# Altium schematic sheet 29.SchDoc
size 513 x 386 mm
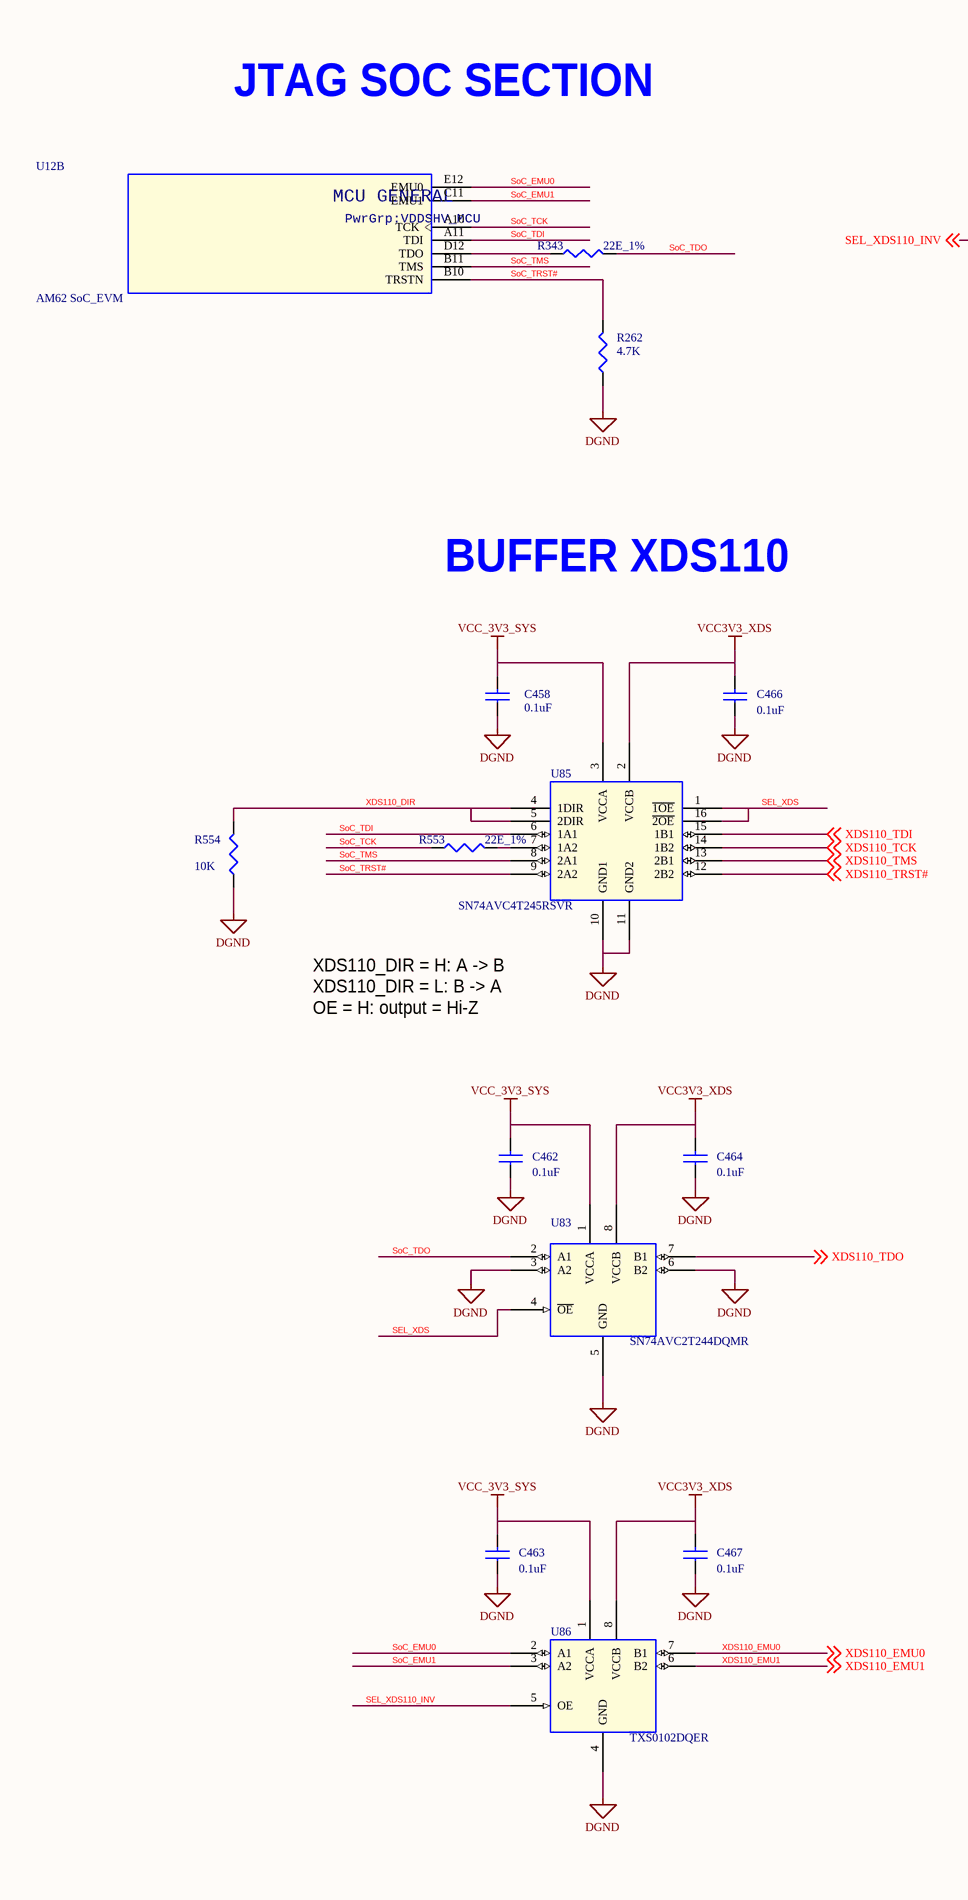
[diagram p0: 29.SchDoc, left]
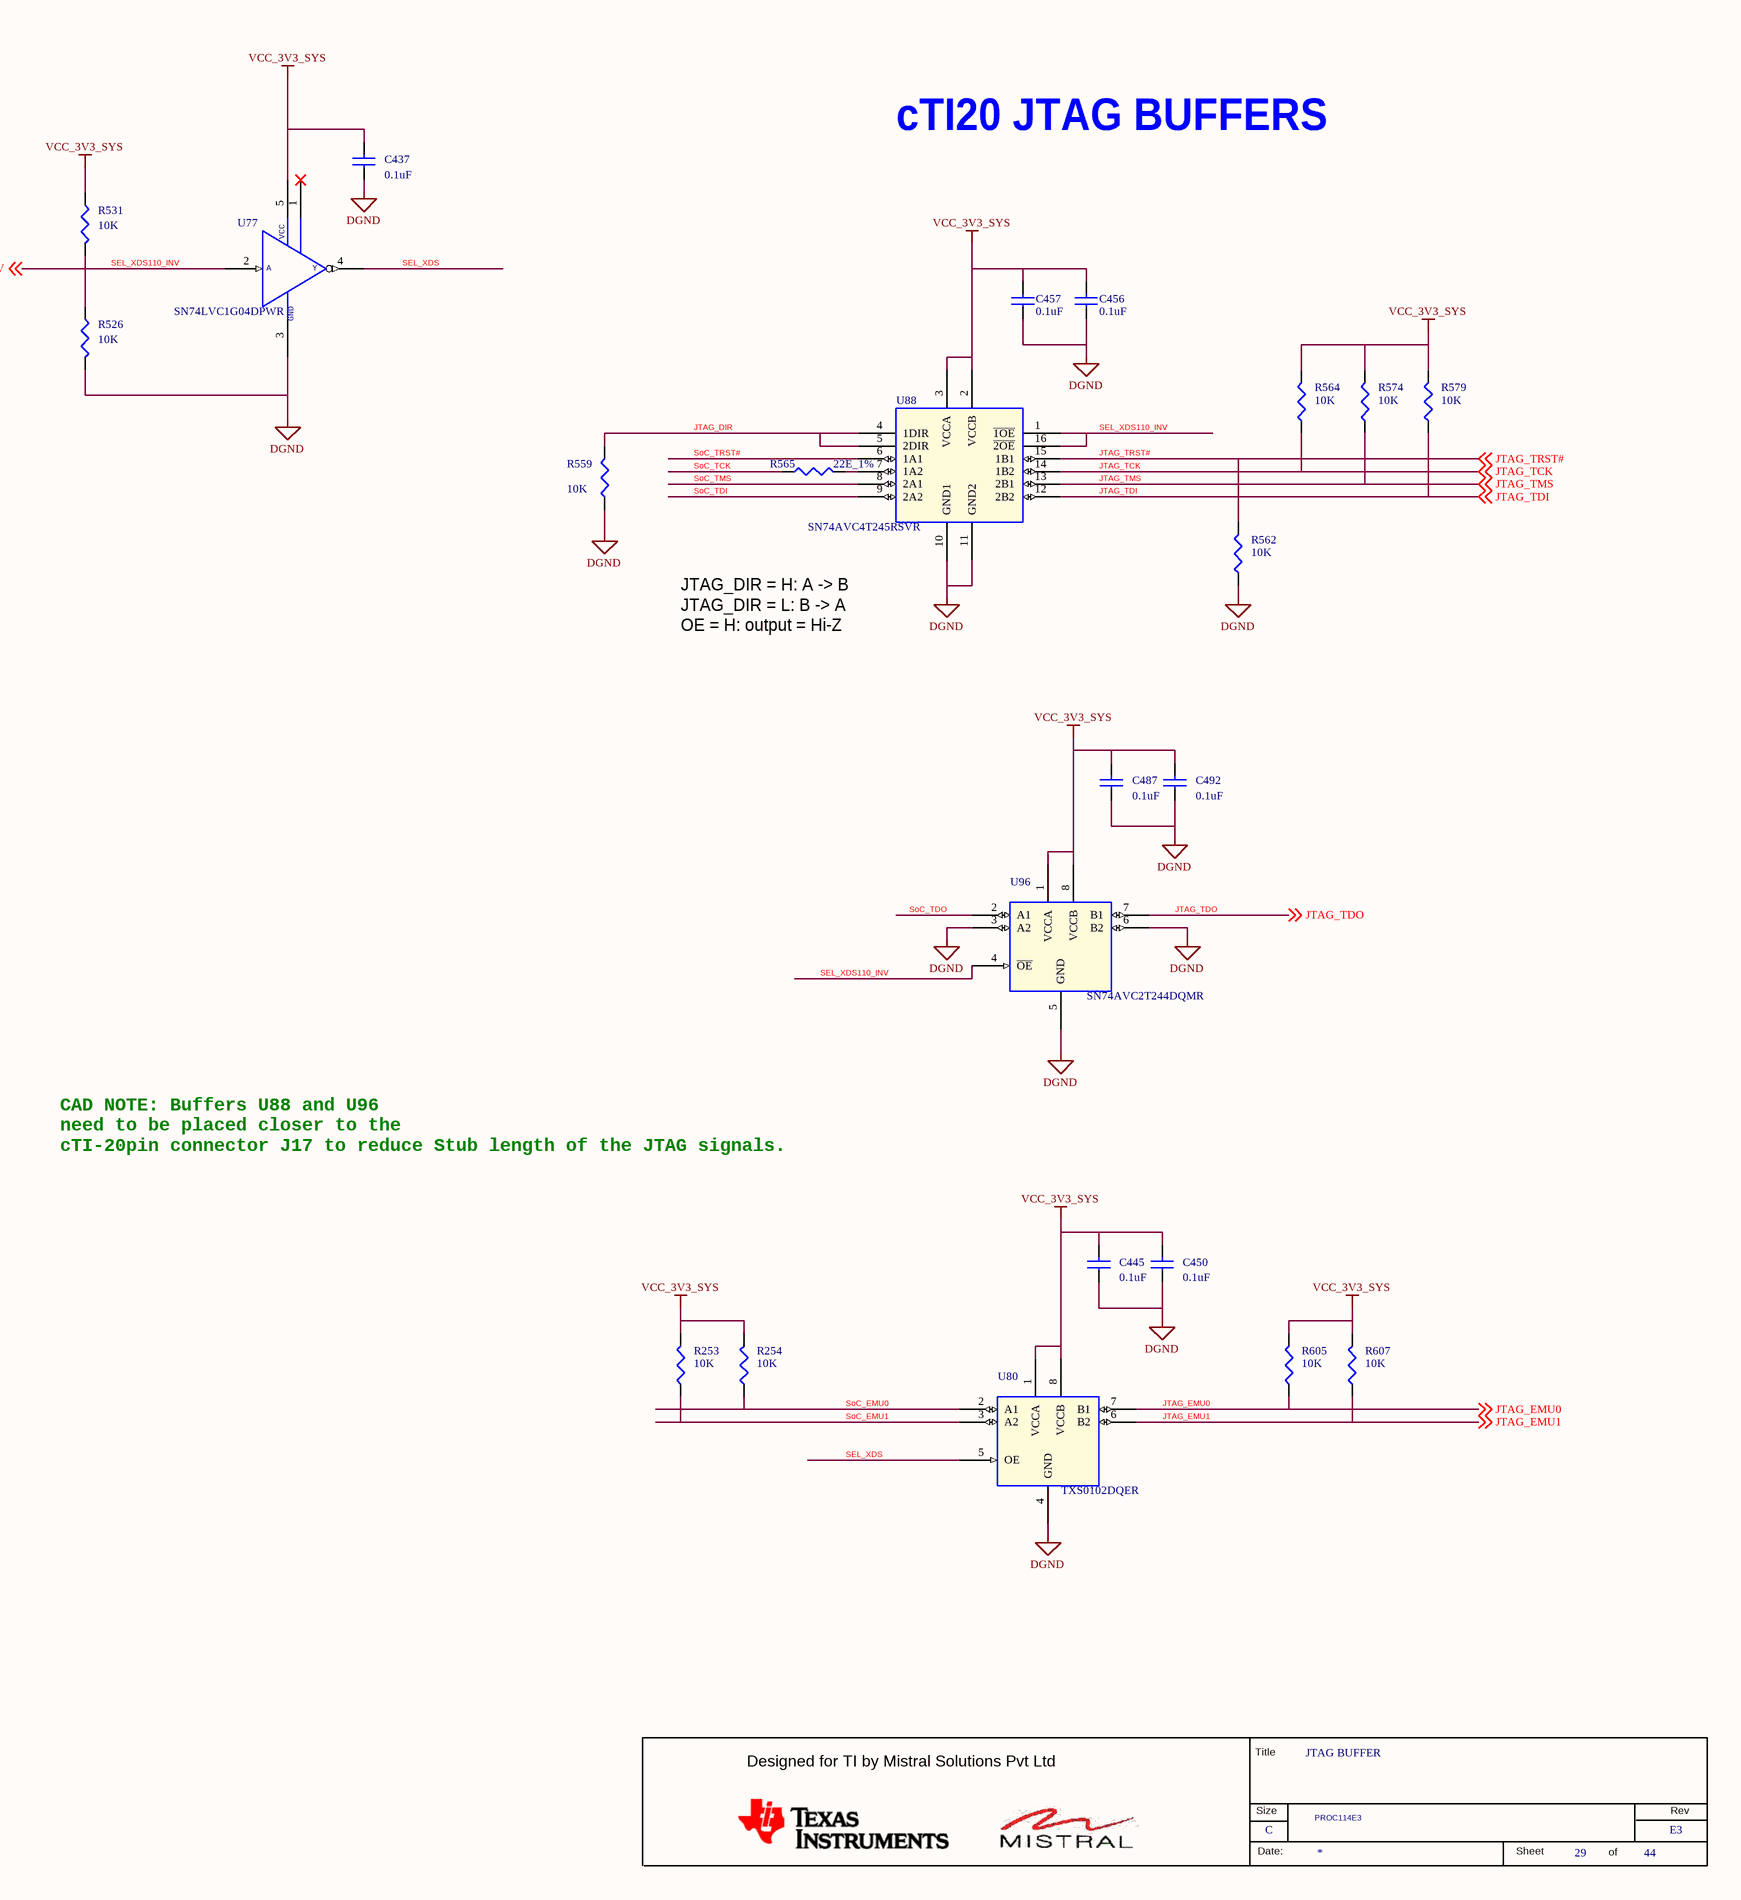
[diagram p1: 29.SchDoc, right]

## Parts
*  RevCode: E3  Title: JTAG BUFFER  Page Size: C  Page Number: 29  Page Count: 44  Variant Name: PROC114E3  (hidden comment: MISTRAL_TITLEBLK_CSIZE)  (graphical)
C437  0.1uF  [CAP0201_0-5]
C445  0.1uF  [CAP0201_0-5]
C450  0.1uF  [CAP0201_0-5]
C456  0.1uF  [CAP0201_0-5]
C457  0.1uF  [CAP0201_0-5]
C458  0.1uF  [CAP0201_0-5]
C462  0.1uF  [CAP0201_0-5]
C463  0.1uF  [CAP0201_0-5]
C464  0.1uF  [CAP0201_0-5]
C466  0.1uF  [CAP0201_0-5]
C467  0.1uF  [CAP0201_0-5]
C487  0.1uF  [CAP0201_0-5]
C492  0.1uF  [CAP0201_0-5]
R253  10K  [RES0201_0-5]
R254  10K  [RES0201_0-5]
R262  4.7K  [RES0201_0-5]
R343  22E_1%  [RES0201_0-5]
R526  10K  [RES0201_0-5]
R531  10K  [RES0201_0-5]
R553  22E_1%  [RES0201_0-5]
R554  10K  [RES0201_0-5]
R559  10K  [RES0201_0-5]
R562  10K  [RES0201_0-5]
R564  10K  [RES0201_0-5]
R565  22E_1%  [RES0201_0-5]
R574  10K  [RES0201_0-5]
R579  10K  [RES0201_0-5]
R605  10K  [RES0201_0-5]
R607  10K  [RES0201_0-5]
U12  AM62 SoC_EVM  [BGA425_19-68_510X510_0-7]  (part B of 18)
U77  SN74LVC1G04DPWR  [X2SON5_TLV7021_30X30_0-4]
U80  TXS0102DQER  [X2SON8_TXS0102_40X60_0-4]
U83  SN74AVC2T244DQMR  [X2SON8_15-74_70X50]
U85  SN74AVC4T245RSVR  [UQFN16_TMUX1574_70X100_0-6]
U86  TXS0102DQER  [X2SON8_TXS0102_40X60_0-4]
U88  SN74AVC4T245RSVR  [UQFN16_TMUX1574_70X100_0-6]
U96  SN74AVC2T244DQMR  [X2SON8_15-74_70X50]

## Nets
DGND: C437.1 C445.1 C450.1 C456.1 C457.1 C458.1 C462.1 C463.1 C464.1 C466.1 C467.1 C487.1 C492.1 R262.2 R526.1 R554.1 R559.1 R562.1 U77.3(GND) U80.4(GND) U83.3(A2) U83.5(GND) U83.6(B2) U85.10(GND1) U85.11(GND2) U86.4(GND) U88.10(GND1) U88.11(GND2) U96.3(A2) U96.5(GND) U96.6(B2)
VCC3V3_XDS: C464.2 C466.2 C467.2 U83.8(VCCB) U85.2(VCCB) U86.8(VCCB)
VCC_3V3_SYS: C437.2 C445.2 C450.2 C456.2 C457.2 C458.2 C462.2 C463.2 C487.2 C492.2 R253.1 R254.1 R531.2 R564.2 R574.2 R579.2 R605.1 R607.1 U77.5(VCC) U80.1(VCCA) U80.8(VCCB) U83.1(VCCA) U85.3(VCCA) U86.1(VCCA) U88.2(VCCB) U88.3(VCCA) U96.1(VCCA) U96.8(VCCB)
JTAG_DIR: R559.2 U88.4(1DIR) U88.5(2DIR)
JTAG_EMU0: R605.2 U80.7(B1) ; off-sheet JTAG_EMU0
JTAG_EMU1: R607.2 U80.6(B2) ; off-sheet JTAG_EMU1
JTAG_TCK: R564.1 U88.14(1B2) ; off-sheet JTAG_TCK
JTAG_TDI: R579.1 U88.12(2B2) ; off-sheet JTAG_TDI
JTAG_TDO: U96.7(B1) ; off-sheet JTAG_TDO
JTAG_TMS: R574.1 U88.13(2B1) ; off-sheet JTAG_TMS
JTAG_TRST#: R562.2 U88.15(1B1) ; off-sheet JTAG_TRST#
SEL_XDS: U77.4(Y) U80.5(OE) U83.4(~{OE}) U85.1(~{1OE}) U85.16(~{2OE})
SEL_XDS110_INV: R526.2 R531.1 U77.2(A) U86.5(OE) U88.1(~{1OE}) U88.16(~{2OE}) U96.4(~{OE}) ; off-sheet SEL_XDS110_INV
SoC_EMU0: R254.2 U12.E12(EMU0) U80.2(A1) U86.2(A1)
SoC_EMU1: R253.2 U12.C11(EMU1) U80.3(A2) U86.3(A2)
SoC_TCK: R553.1 R565.1 U12.A10(TCK)
SoC_TDI: U12.A11(TDI) U85.6(1A1) U88.9(2A2)
SoC_TDO: R343.1 U83.2(A1) U96.2(A1)
SoC_TMS: U12.B11(TMS) U85.8(2A1) U88.8(2A1)
SoC_TRST#: R262.1 U12.B10(TRSTN) U85.9(2A2) U88.6(1A1)
XDS110_DIR: R554.2 U85.4(1DIR) U85.5(2DIR)
XDS110_EMU0: U86.7(B1) ; off-sheet XDS110_EMU0
XDS110_EMU1: U86.6(B2) ; off-sheet XDS110_EMU1
XDS110_TCK: U85.14(1B2) ; off-sheet XDS110_TCK
XDS110_TDI: U85.15(1B1) ; off-sheet XDS110_TDI
XDS110_TDO: U83.7(B1) ; off-sheet XDS110_TDO
XDS110_TMS: U85.13(2B1) ; off-sheet XDS110_TMS
XDS110_TRST#: U85.12(2B2) ; off-sheet XDS110_TRST#
NetR343_2: R343.2 U12.D12(TDO)
NetR553_2: R553.2 U85.7(1A2)
NetR565_2: R565.2 U88.7(1A2)

Not connected (* = marked no-connect by the designer): U77 1(NC)*

## Notes on the sheet
- JTAG SOC SECTION
- cTI20 JTAG BUFFERS
- JTAG_DIR = H: A -> B
  JTAG_DIR = L: B -> A
  OE = H: output = Hi-Z
- BUFFER XDS110
- XDS110_DIR = H: A -> B
  XDS110_DIR = L: B -> A
  OE = H: output = Hi-Z
- CAD NOTE: Buffers U88 and U96
  need to be placed closer to the
  cTI-20pin connector J17 to reduce Stub length of the JTAG signals.
- (in symbol AM62-EVM_BGA425, part B) MCU GENERAL; PwrGrp:VDDSHV_MCU
- (in symbol MISTRAL_TITLEBLK_CSIZE) Title; Designed for TI by Mistral Solutions Pvt Ltd; Size; Rev; Date:; Sheet; of

## Library data of the parts
* = MISTRAL_TITLEBLK_CSIZE: Issue: 1.0; Page Create Date: March  8, 1995; Page Modify Date: *; Schematic Page Count: 44; Schematic Page Number: 29
C437 C445 C466 C467 C492 = CAP_Dup2: CAP CERAMIC 0.1uF 16V 10% X5R 0201; Alt_Mfr_name: YAGEO AMERICA; Part_type: CAPACITORS\CERAMIC; Mfr_part_number: GRM033R61C104KE14D; Mfr_name: MURATA; Mistral Part No: 120009030072-R; Alt_Mfr_part_number: CC0402KRX5R8BB104; Custom_Duty: 15%; Customs_HS_Code: 85322990; Wattage: NA; Project: TI_MAXIE_CPB; PCB Footprint: CAP0201_0-5; Footprint Path: Y:\MIS_DATABASE\Library\ALTIUM_TOOL\PCB_FOOTPRINTS\Altium_Footprint_Lib.PcbLib; Library Path: Y:\MIS_DATABASE\Library\ALTIUM_TOOL\SCHEMATICS_PARTS\MS_DISCRETE_Library.schlib; Footprint Ref: CAP0201_0-5; Library Ref: CAP; MECHANICAL 3D STEP FILE: CAP0201_0-5; Chkd/date: MANIRAJA/230118; Crtd /date: MANIRAJA/230118; Datasheet: Y:\MIS_DATABASE\DATASHEETS\CAPACITORS\GRM033R61C104KE14.PDF; Temperature: -55°C+85°C; Weight: 0.33mg; Height: 0.33MM; Distributor_part_number: 490-14305-1-ND; Distributor_name: DIGIKEY; Package: 0201; Voltage: 16V; Tolerance: 10%
C450 C456-C458 C462-C464 C487 = CAP_Dup2: CAP CERAMIC 0.1uF 16V 10% X5R 0201; Alt_Mfr_part_number: CC0402KRX5R8BB104; Mistral Part No: 120009030072-R; Mfr_name: MURATA; Mfr_part_number: GRM033R61C104KE14D; Part_type: CAPACITORS\CERAMIC; Alt_Mfr_name: YAGEO AMERICA; Project: TI_MAXIE_CPB; Wattage: NA; Customs_HS_Code: 85322990; Custom_Duty: 15%; PCB Footprint: CAP0201_0-5; Tolerance: 10%; Voltage: 16V; Package: 0201; Distributor_name: DIGIKEY; Distributor_part_number: 490-14305-1-ND; Height: 0.33MM; Weight: 0.33mg; Temperature: -55°C+85°C; Datasheet: Y:\MIS_DATABASE\DATASHEETS\CAPACITORS\GRM033R61C104KE14.PDF; Crtd /date: MANIRAJA/230118; Chkd/date: MANIRAJA/230118; MECHANICAL 3D STEP FILE: CAP0201_0-5; Library Ref: CAP; Footprint Ref: CAP0201_0-5; Library Path: Y:\MIS_DATABASE\Library\ALTIUM_TOOL\SCHEMATICS_PARTS\MS_DISCRETE_Library.schlib; Footprint Path: Y:\MIS_DATABASE\Library\ALTIUM_TOOL\PCB_FOOTPRINTS\Altium_Footprint_Lib.PcbLib
R253 R531 R554 R562 R605 = RESISTOR_Dup6: RES 10K 1/20W 5% 0201; Part_type: RESISTORS\FIXED; Mfr_part_number: RC0201JR-0710KL; Mfr_name: YAGEO AMERICA; Mistral Part No: 110010070051-R; Custom_Duty: 15%; Customs_HS_Code: 85332119; Voltage: NA; Project: GOLDEN-I LITE; Footprint Path: Y:\MIS_DATABASE\Library\ALTIUM_TOOL\PCB_FOOTPRINTS\Altium_Footprint_Lib.PcbLib; Library Path: Y:\MIS_DATABASE\Library\ALTIUM_TOOL\SCHEMATICS_PARTS\MS_DISCRETE_Library.schlib; MECHANICAL 3D STEP FILE: RES0201_0-5; Chkd/date: MANIRAJA/050517; Crtd /date: MANIRAJA/050517; Datasheet: Y:\MIS_DATABASE\DATASHEETS\RESISTORS\RCXXXXL-SER_MAR18.PDF; Temperature: -55°C+125°C; Weight: 0.17mg; Height: 0.26MM; Library Ref: RESISTOR; Distributor_part_number: 311-10KNCT-ND; Distributor_name: DIGIKEY; Package: 0201; Wattage: 1/20W; Tolerance: 5%; Footprint Ref: RES0201_0-5; PCB Footprint: RES0201_0-5
R254 R526 R559 R564 R574 R579 R607 = RESISTOR_Dup6: RES 10K 1/20W 5% 0201; Mistral Part No: 110010070051-R; Mfr_name: YAGEO AMERICA; Mfr_part_number: RC0201JR-0710KL; Part_type: RESISTORS\FIXED; Project: GOLDEN-I LITE; Voltage: NA; Customs_HS_Code: 85332119; Custom_Duty: 15%; Footprint Ref: RES0201_0-5; Tolerance: 5%; Wattage: 1/20W; Package: 0201; Distributor_name: DIGIKEY; Distributor_part_number: 311-10KNCT-ND; Library Ref: RESISTOR; Height: 0.26MM; Weight: 0.17mg; Temperature: -55°C+125°C; Datasheet: Y:\MIS_DATABASE\DATASHEETS\RESISTORS\RCXXXXL-SER_MAR18.PDF; Crtd /date: MANIRAJA/050517; Chkd/date: MANIRAJA/050517; MECHANICAL 3D STEP FILE: RES0201_0-5; Library Path: Y:\MIS_DATABASE\Library\ALTIUM_TOOL\SCHEMATICS_PARTS\MS_DISCRETE_Library.schlib; Footprint Path: Y:\MIS_DATABASE\Library\ALTIUM_TOOL\PCB_FOOTPRINTS\Altium_Footprint_Lib.PcbLib; PCB Footprint: RES0201_0-5
R262 = RESISTOR_Dup6: RES 4.7K 1/20W 5% 0201; Part_type: RESISTORS\FIXED; Mfr_part_number: RC0201JR-074K7L; Mfr_name: YAGEO AMERICA; Mistral Part No: 110021090007-R; Custom_Duty: 15%; Customs_HS_Code: 85332119; Voltage: NA; Project: TI_AM62x SKEVM_BRD; PCB Footprint: RES0201_0-5; Footprint Path: Y:\MIS_DATABASE\Library\ALTIUM_TOOL\PCB_FOOTPRINTS\Altium_Footprint_Lib.PcbLib; Library Path: Y:\MIS_DATABASE\Library\ALTIUM_TOOL\SCHEMATICS_PARTS\MS_DISCRETE_Library.schlib; MECHANICAL 3D STEP FILE: RES0201_0-5; Chkd/date: MANIRAJA/200921; Crtd /date: ALVY/200921; Datasheet: Y:\MIS_DATABASE\DATASHEETS\RESISTORS\RCXXXXL-SER_MAR18.PDF; Temperature: -55°C+125°C; Weight: 0.17mg; Height: 0.26MM; Library Ref: RESISTOR; Distributor_part_number: 311-4.7KNCT-ND; Distributor_name: DIGIKEY; Package: 0201; Wattage: 1/20W; Tolerance: 5%; Footprint Ref: RES0201_0-5
R343 R553 R565 = RESISTOR_Dup6: RES 22E 1/20W 1% 0201; Mistral Part No: 110009030522-R; Mfr_name: YAGEO AMERICA; Mfr_part_number: RC0201FR-0722RL; Part_type: RESISTORS\FIXED; Project: AM654x_SOM; Voltage: NA; Customs_HS_Code: 85332119; Custom_Duty: 15%; PCB Footprint: RES0201_0-5; Footprint Ref: RES0201_0-5; Tolerance: 1%; Wattage: 1/20W; Package: 0201; Distributor_name: DIGIKEY; Distributor_part_number: YAG2518CT-ND; Library Ref: RESISTOR; Height: 0.26MM; Weight: 0.17mg; Temperature: -55°C+125°C; Datasheet: Y:\MIS_DATABASE\DATASHEETS\RESISTORS\RCXXXXL-SER_MAR18.PDF; Crtd /date: ALVY/080319; Chkd/date: MANIRAJA/080319; MECHANICAL 3D STEP FILE: RES0201_0-5; Library Path: Y:\MIS_DATABASE\Library\ALTIUM_TOOL\SCHEMATICS_PARTS\MS_DISCRETE_Library.schlib; Footprint Path: Y:\MIS_DATABASE\Library\ALTIUM_TOOL\PCB_FOOTPRINTS\Altium_Footprint_Lib.PcbLib
U12 = AM62-EVM_BGA425: IC AM62 SoC MICROPROCESSOR BGA425; Mistral Part No: 141221060001; Mfr_name: TEXAS INSTRUMENTS; Part_type: ICS\DIGITAL\MICROPROCESSOR; Project: AM62_EVM_BRD; Tolerance: NA; Customs_HS_Code: 85423100; Custom_Duty: 15%; PCB Footprint: BGA425_19-68_510X510_0-7; Mfr_part_number: AM62 SoC_EVM; Voltage: NA; Wattage: NA; Package: BGA425; Distributor_name: NA; Distributor_part_number: NA; Library Ref: AM62-EVM_BGA425; Footprint Ref: BGA425_19-68_510X510_0-7; Height: 0.65MM; Weight: NA; Temperature: NA; Datasheet: Y:\MIS_DATABASE\DATASHEETS\ICS\DIGITAL\MICROCONTROLLER\AM62-SoC_SVB.PDF; Crtd /date: MANIRAJA/110621; Chkd/date: ALVY/110621; RoHS: NA; MECHANICAL 3D STEP FILE: BGA425_19-68_510X510_0-7; Library Path: Y:\MIS_DATABASE\Library\ALTIUM_TOOL\SCHEMATICS_PARTS\MS_MICROPROCESSOR_Library.schlib; Footprint Path: Y:\MIS_DATABASE\Library\ALTIUM_TOOL\PCB_FOOTPRINTS\Altium_Footprint_Lib.PcbLib
U77 = SN74LVC1G04DCKR_SC70-5: IC SINGLE INVERTER GATE X2SON5; Part_type: ICS\DIGITAL\GATES; Mfr_name: TEXAS INSTRUMENTS; Mistral Part No: 141020100010-R; Custom_Duty: 15%; Customs_HS_Code: 85423100; Wattage: NA; Project: AM64X_SKEVM; PCB Footprint: X2SON5_TLV7021_30X30_0-4; Footprint Path: Y:\MIS_DATABASE\Library\ALTIUM_TOOL\PCB_FOOTPRINTS\Altium_Footprint_Lib.PcbLib; Library Path: Y:\MIS_DATABASE\Library\ALTIUM_TOOL\SCHEMATICS_PARTS\MS_GATE_Library.schlib; MECHANICAL 3D STEP FILE: X2SON5_TLV7021_30X30_0-4; Chkd/date: MANIRAJA/141020; Crtd /date: ALVY/131020; Datasheet: Y:\MIS_DATABASE\DATASHEETS\ICS\DIGITAL\GATES\SN74LVC1G04XX.PDF; Temperature: -40°C+125°C; Weight: 0.6mg; Height: 0.40MM; Library Ref: SN74LVC1G04DCKR_SC70-5; Distributor_part_number: 296-37758-1-ND; Distributor_name: DIGIKEY; Package: X2SON5; Voltage: NA; Tolerance: NA; Mfr_part_number: SN74LVC1G04DPWR; Footprint Ref: X2SON5_TLV7021_30X30_0-4
U80 = TXS0102DQX_SON8: IC 2-BIT BI-DIR VOLTAGE-LEVEL TRANSLATOR FOR OPEN-DRAIN AND PUSH-PULL X2SON8; Part_type: ICS\INTERFACE\LEVEL TRANSLATOR; Mfr_name: TEXAS INSTRUMENTS; Mistral Part No: 141012050010-R; Custom_Duty: 15%; Customs_HS_Code: 85423100; Wattage: NA; Project: GEN_3-8_DB; PCB Footprint: X2SON8_TXS0102_40X60_0-4; Footprint Path: Y:\MIS_DATABASE\Library\ALTIUM_TOOL\PCB_FOOTPRINTS\Altium_Footprint_Lib.PcbLib; Library Path: Y:\MIS_DATABASE\Library\ALTIUM_TOOL\SCHEMATICS_PARTS\MS_MISCINTERFACE_Library.schlib; MECHANICAL 3D STEP FILE: X2SON8_TXS0102_40X60_0-4; Chkd/date: MANIRAJA/010719; Crtd /date: CHAITHANYA230512; Datasheet: Y:\MIS_DATABASE\DATASHEETS\ICS\INTERFACE\TXS0102-SER.PDF; Temperature: -40°C+85°C; Weight: 1.2mg; Height: 0.40MM; Library Ref: TXS0102DQX_SON8; Distributor_part_number: 296-28368-1-ND; Distributor_name: DIGIKEY; Package: X2SON8; Voltage: NA; Tolerance: NA; Mfr_part_number: TXS0102DQER; Footprint Ref: X2SON8_TXS0102_40X60_0-4
U83 = SN74AVC2T244DQMR_X2SON8: IC 2-BIT UNDIRECTIONAL VOLTAGE-LEVEL TRANSLATOR X2SON8; Part_type: ICS\INTERFACE\LEVEL TRANSLATOR; Mfr_name: TEXAS INSTRUMENTS; Mistral Part No: 141016030002-R; Customs_HS_Code: 15%; Pb-Free: 85423100; Wattage: NA; Project: OCTASIC_3600; PCB Footprint: X2SON8_15-74_70X50; Chkd/date: VASANTHA/060516; Crtd /date: VASANTHA/030316; Datasheet: Y:\MIS_DATABASE\DATASHEETS\ICS\INTERFACE\SN74AVC2T244.PDF; Temperature: -40°C+85°C; Weight: NA; Height: 0.40MM; Distributor_part_number: 296-29674-1-ND; Distributor_name: DIGIKEY; Package: X2SON8; Voltage: NA; Tolerance: NA; Mfr_part_number: SN74AVC2T244DQMR; Library Ref: SN74AVC2T244DQMR_X2SON8
U85 = SN74AVC4T245RSV_UQFN16: IC 2-BIT BUS TRANSCEIVER WITH CONFIGURABLE VOLTAGE TRANSLATION AND 3 STATE O/P UQFN16; Part_type: ICS\DIGITAL\BUSTRANSCEIVER; Mfr_name: TEXAS INSTRUMENTS; Mistral Part No: 141011040011-R; Custom_Duty: 15%; Customs_HS_Code: 85423100; Wattage: NA; Project: HMC; PCB Footprint: UQFN16_TMUX1574_70X100_0-6; Footprint Path: Y:\MIS_DATABASE\Library\ALTIUM_TOOL\PCB_FOOTPRINTS\Altium_Footprint_Lib.PcbLib; Library Path: Y:\MIS_DATABASE\Library\ALTIUM_TOOL\SCHEMATICS_PARTS\MS_BUSDRIVERTRANSCEIVER_Library.schlib; MECHANICAL 3D STEP FILE: UQFN16_TMUX1574_70X100_0-6; Chkd/date: MANIRAJA/040520; Crtd /date: BAVISH/190411; Datasheet: Y:\MIS_DATABASE\DATASHEETS\ICS\DIGITAL\BUSTRANSCEIVER\SN74AVC4T245-SER.PDF; Temperature: -40°C+85°C; Weight: 41mg; Height: 0.55MM; Library Ref: SN74AVC4T245RSV_UQFN16; Distributor_part_number: 296-24366-1-ND; Distributor_name: DIGIKEY; Package: UQFN16; Voltage: NA; Tolerance: NA; Mfr_part_number: SN74AVC4T245RSVR; Footprint Ref: UQFN16_TMUX1574_70X100_0-6
U86 = TXS0102DQX_SON8: IC 2-BIT BI-DIR VOLTAGE-LEVEL TRANSLATOR FOR OPEN-DRAIN AND PUSH-PULL X2SON8; Mistral Part No: 141012050010-R; Mfr_name: TEXAS INSTRUMENTS; Part_type: ICS\INTERFACE\LEVEL TRANSLATOR; Project: GEN_3-8_DB; Tolerance: NA; Customs_HS_Code: 85423100; Custom_Duty: 15%; PCB Footprint: X2SON8_TXS0102_40X60_0-4; Footprint Ref: X2SON8_TXS0102_40X60_0-4; Mfr_part_number: TXS0102DQER; Voltage: NA; Wattage: NA; Package: X2SON8; Distributor_name: DIGIKEY; Distributor_part_number: 296-28368-1-ND; Library Ref: TXS0102DQX_SON8; Height: 0.40MM; Weight: 1.2mg; Temperature: -40°C+85°C; Datasheet: Y:\MIS_DATABASE\DATASHEETS\ICS\INTERFACE\TXS0102-SER.PDF; Crtd /date: CHAITHANYA230512; Chkd/date: MANIRAJA/010719; MECHANICAL 3D STEP FILE: X2SON8_TXS0102_40X60_0-4; Library Path: Y:\MIS_DATABASE\Library\ALTIUM_TOOL\SCHEMATICS_PARTS\MS_MISCINTERFACE_Library.schlib; Footprint Path: Y:\MIS_DATABASE\Library\ALTIUM_TOOL\PCB_FOOTPRINTS\Altium_Footprint_Lib.PcbLib
U88 = SN74AVC4T245RSV_UQFN16: IC 2-BIT BUS TRANSCEIVER WITH CONFIGURABLE VOLTAGE TRANSLATION AND 3 STATE O/P UQFN16; Mistral Part No: 141011040011-R; Mfr_name: TEXAS INSTRUMENTS; Part_type: ICS\DIGITAL\BUSTRANSCEIVER; Project: HMC; Tolerance: NA; Customs_HS_Code: 85423100; Custom_Duty: 15%; PCB Footprint: UQFN16_TMUX1574_70X100_0-6; Footprint Ref: UQFN16_TMUX1574_70X100_0-6; Mfr_part_number: SN74AVC4T245RSVR; Voltage: NA; Wattage: NA; Package: UQFN16; Distributor_name: DIGIKEY; Distributor_part_number: 296-24366-1-ND; Library Ref: SN74AVC4T245RSV_UQFN16; Height: 0.55MM; Weight: 41mg; Temperature: -40°C+85°C; Datasheet: Y:\MIS_DATABASE\DATASHEETS\ICS\DIGITAL\BUSTRANSCEIVER\SN74AVC4T245-SER.PDF; Crtd /date: BAVISH/190411; Chkd/date: MANIRAJA/040520; MECHANICAL 3D STEP FILE: UQFN16_TMUX1574_70X100_0-6; Library Path: Y:\MIS_DATABASE\Library\ALTIUM_TOOL\SCHEMATICS_PARTS\MS_BUSDRIVERTRANSCEIVER_Library.schlib; Footprint Path: Y:\MIS_DATABASE\Library\ALTIUM_TOOL\PCB_FOOTPRINTS\Altium_Footprint_Lib.PcbLib
U96 = SN74AVC2T244DQMR_X2SON8: IC 2-BIT UNDIRECTIONAL VOLTAGE-LEVEL TRANSLATOR X2SON8; Mistral Part No: 141016030002-R; Mfr_name: TEXAS INSTRUMENTS; Part_type: ICS\INTERFACE\LEVEL TRANSLATOR; Project: OCTASIC_3600; Tolerance: NA; Pb-Free: 85423100; Customs_HS_Code: 15%; PCB Footprint: X2SON8_15-74_70X50; Library Ref: SN74AVC2T244DQMR_X2SON8; Mfr_part_number: SN74AVC2T244DQMR; Voltage: NA; Wattage: NA; Package: X2SON8; Distributor_name: DIGIKEY; Distributor_part_number: 296-29674-1-ND; Height: 0.40MM; Weight: NA; Temperature: -40°C+85°C; Datasheet: Y:\MIS_DATABASE\DATASHEETS\ICS\INTERFACE\SN74AVC2T244.PDF; Crtd /date: VASANTHA/030316; Chkd/date: VASANTHA/060516